# Altium schematic sheet V831.SchDoc
size A4; SheetNumber: 1; SheetTotal: 2
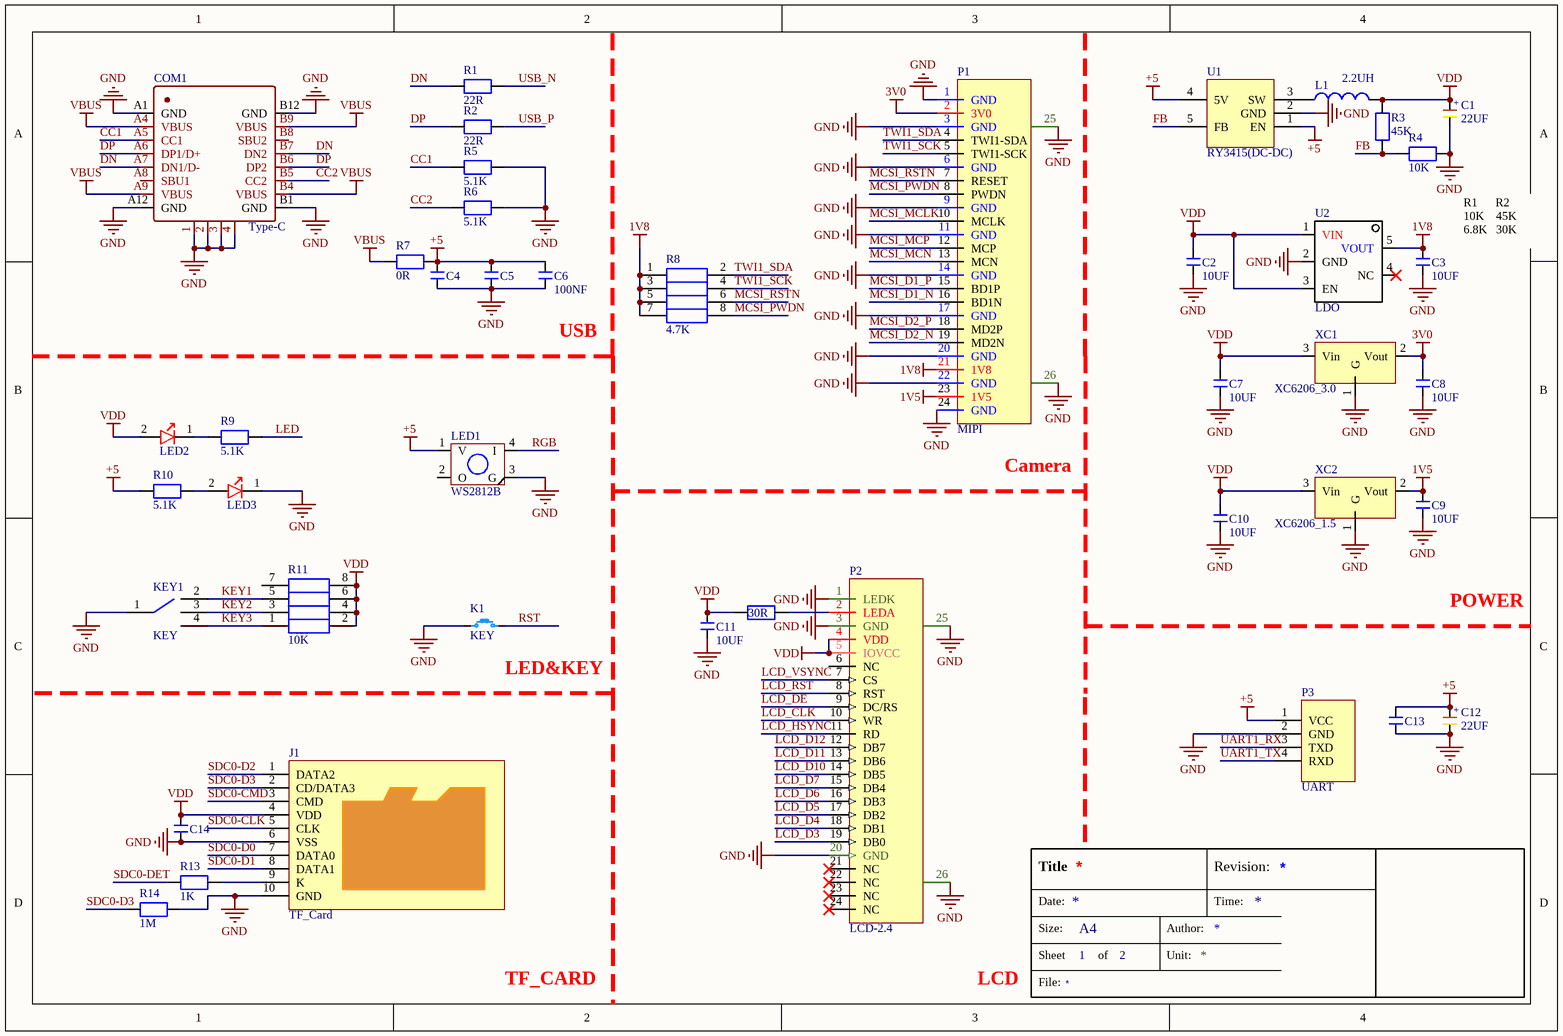
[diagram p0: V831.SchDoc]

## Parts
C1  22UF  [CAP_3216_A]
C2  10UF  [CAP_1206]
C3  10UF  [CAP_0603]
C4  100NF  [CAP_0603]  (value not drawn)
C5  100NF  [CAP_0603]  (value not drawn)
C6  100NF  [CAP_0603]
C7  10UF  [CAP_0603]
C8  10UF  [CAP_0603]
C9  10UF  [CAP_0603]
C10  10UF  [CAP_0603]
C11  10UF  [CAP_0603]
C12  22UF  [CAP_3216_A]
C13  100NF  [CAP_0603]  (value not drawn)
C14  100NF  [CAP_0603]  (value not drawn)
COM1  Type-C  [USB-Type-C_16A]
J1  TF_Card  [TF_Card]
K1  KEY  [KEY_SMD-4P]
KEY1  KEY  [KEY-K1-1502SA-LY-K3]
L1  2.2UH  [INDUCTANCE_4*4]
LED1  WS2812B  [WS2812B]
LED2  LED_R/G/B/Y  [LED_0603_B]  (value not drawn)
LED3  LED_R/G/B/Y  [LED_0603_R]  (value not drawn)
P1  MIPI  [FPC-24Pin]
P2  LCD-2.4  [FPC-24PIN-FB]
P3  UART  [XH2.54-WS-4P]
R1  22R  [RESC_0603_2]
R2  22R  [RESC_0603_2]
R3  45K  [RESC_0603_2]
R4  10K  [RESC_0603_2]
R5  5.1K  [RESC_0603_2]
R6  5.1K  [RESC_0603_2]
R7  0R  [RESC_0603_2]
R8  4.7K  [RESC_0603_4]
R9  5.1K  [RESC_0603_2]
R10  5.1K  [RESC_0603_2]
R11  10K  [RESC_0603_4]
R12  30R  [RESC_0603_2]
R13  1K  [RESC_0603_2]
R14  1M  [RESC_0603_2]
U1  RY3415(DC-DC)  [SOT23_5]
U2  LDO  [SOT23_5]
XC1  XC6206_3.0  [SOT23_3]
XC2  XC6206_1.5  [SOT23_3]

## Nets
1V5: C9.2 P1.23(1V5) XC2.2(Vout)
1V8: C3.2 P1.21(1V8) R8.1 R8.3 R8.5 R8.7 U2.5(VOUT)
3V0: C8.2 P1.2(3V0) XC1.2(Vout)
+5: C4.2 C5.2 C6.2 C12.1 C13.2 LED1.1(V) P3.1(VCC) R7.2 R10.1 U1.1(EN) U1.4(5V)
GND: C1.2 C2.1 C3.1 C4.1 C5.1 C6.1 C7.1 C8.1 C9.1 C10.1 C11.1 C12.2 C13.1 C14.1 COM1.1 COM1.2 COM1.3 COM1.4 COM1.A1(GND) COM1.A12(GND) COM1.B1(GND) COM1.B12(GND) J1.6(VSS) J1.10(GND) K1.1 KEY1.1 LED1.3(G) LED3.1(-) P1.1(GND) P1.3(GND) P1.6(GND) P1.9(GND) P1.11(GND) P1.14(GND) P1.17(GND) P1.20(GND) P1.22(GND) P1.24(GND) P1.25(GND) P1.26(GND) P2.1(LEDK) P2.3(GND) P2.20(GND) P2.25(GND) P2.26(GND) P3.2(GND) R4.2 R5.2 R6.2 R14.2 U1.2(GND) U2.2(GND) XC1.1(G) XC2.1(G)
VBUS: COM1.A4(VBUS) COM1.A9(VBUS) COM1.B4(VBUS) COM1.B9(VBUS) R7.1
VDD: C1.1 C2.2 C7.2 C10.2 C11.2 C14.2 J1.4(VDD) L1.2 LED2.2(+) P2.4(VDD) P2.5(IOVCC) R3.1 R11.2 R11.4 R11.6 R11.8 R12.2 U2.1(VIN) U2.3(EN) XC1.3(Vin) XC2.3(Vin)
CC1: COM1.A5(CC1) R5.1
CC2: COM1.B5(CC2) R6.1
DN: COM1.A7(DN1/D-) COM1.B7(DN2) R1.1
DP: COM1.A6(DP1/D+) COM1.B6(DP2) R2.1
FB: R3.2 R4.1 U1.5(FB)
KEY1: KEY1.2 R11.5
KEY2: KEY1.3 R11.3
KEY3: KEY1.4 R11.1
LCD_CLK: P2.10(WR)
LCD_D3: P2.19(DB0)
LCD_D4: P2.18(DB1)
LCD_D5: P2.17(DB2)
LCD_D6: P2.16(DB3)
LCD_D7: P2.15(DB4)
LCD_D10: P2.14(DB5)
LCD_D11: P2.13(DB6)
LCD_D12: P2.12(DB7)
LCD_DE: P2.9(DC/RS)
LCD_HSYNC: P2.11(RD)
LCD_RST: P2.8(RST)
LCD_VSYNC: P2.7(CS)
LED: R9.2
MCSI_D1_N: P1.16(BD1N)
MCSI_D1_P: P1.15(BD1P)
MCSI_D2_N: P1.19(MD2N)
MCSI_D2_P: P1.18(MD2P)
MCSI_MCLK: P1.10(MCLK)
MCSI_MCN: P1.13(MCN)
MCSI_MCP: P1.12(MCP)
MCSI_PWDN: P1.8(PWDN) R8.8
MCSI_RSTN: P1.7(RESET) R8.6
RGB: LED1.4(I)
RST: K1.2
SDC0-CLK: J1.5(CLK)
SDC0-CMD: J1.3(CMD)
SDC0-D0: J1.7(DATA0)
SDC0-D1: J1.8(DATA1)
SDC0-D2: J1.1(DATA2)
SDC0-D3: J1.2(CD/DATA3) R14.1
SDC0-DET: R13.1
TWI1_SCK: P1.5(TWI1-SCK) R8.4
TWI1_SDA: P1.4(TWI1-SDA) R8.2
UART1_RX: P3.3(TXD)
UART1_TX: P3.4(RXD)
USB_N: R1.2
USB_P: R2.2
NetJ1_9: J1.9(K) R13.2
NetL1_1: L1.1 U1.3(SW)
NetLED2_1: LED2.1(-) R9.1
NetLED3_2: LED3.2(+) R10.2
NetP2_2: P2.2(LEDA) R12.1

Not connected (* = marked no-connect by the designer): COM1 A8(SBU1) B8(SBU2); LED1 2(O); P2 6(NC) 21(NC)* 22(NC)* 23(NC)* 24(NC)*; R11 7; U2 4(NC)*

## Notes on the sheet
- R1      R2
  10K    45K
  6.8K   30K
- (near C6) USB
- (near P1) Camera
- POWER
- (near K1) LED&KEY
- TF_CARD
- LCD
- Title
- Date:
- Revision:
- Time:
- File:
- Size:
- Sheet
- A4
- of
- Author:
- Unit:
- (in symbol CAP_TA) +

## Library data of the parts
C1 C12 = CAP_TA: CAP  6~12V  钽电容
C2-C11 C13 C14 = CAP: CAP  12~50V
COM1 = USB-type_c: USB
J1 = TF_Card: TF卡座
KEY1 = LY-K3
L1 = Inductor: Code_IEC: 1005; Published: 8-Jun-2000; LatestRevisionDate: 29-May-2009; LatestRevisionNote: IPC-7351 Footprint Added.; PackageReference: 0402-A; Publisher: Altium Limited; PackageDescription: Chip Inductor; Code_JEITA: 0402
LED1 = WS2812B: LED
LED2 LED3 = LED_SMT: LED
P1 = MIPI: OV2465&VS3205
P2 = LCD-ST7789-Pin24: Show 2.4-2.8寸
P3 = UART: Header
R1-R7 R9 R10 R12-R14 = RES: RES 贴片
R8 R11 = RES_P4: RES
U1 = RY3415
U2 = LDO_SOT23-5: LDO  3.3V  500ma
XC1 XC2 = XC6206: DC-DC